# Altium schematic sheet 同向10倍放大.SchDoc
size A4
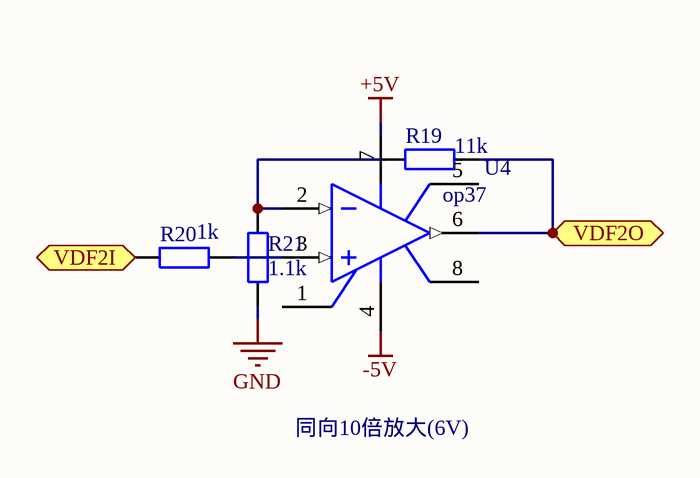
[diagram p0: 同向10倍放大.SchDoc]

## Parts
R19  value 11k  [AXIAL-0.4]  (hidden comment: Res2)
R20  value 1k  [AXIAL-0.4]  (hidden comment: Res2)
R21  value 1.1k  [AXIAL-0.4]  (hidden comment: Res2)
U4  op37  [N-8_A]

## Ports
VDF2I (in), VDF2O (out)

## Nets
+5V: U4.7(V+)
-5V: U4.4(V-)
GND: R21.1
VDF2I: R20.1 ; port VDF2I
VDF2O: R19.2 U4.6(OUT) ; port VDF2O
NetR19_1: R19.1 R21.2 U4.2(IN-)
NetR20_2: R20.2 U4.3(IN+)

Not connected (* = marked no-connect by the designer): U4 1(NULL1) 5(NC) 8(NULL2)

## Notes on the sheet
- 同向10倍放大(6V)
- 标题
- 日期
- 红外数字模拟接收一体机
- 2015 5 29
- 作者
- 模电组
- 单位
- 电子技术协会

## Library data of the parts
R19-R21 = Res2: Resistor; Published: 8-Jun-2000; LatestRevisionDate: 17-Jul-2002; LatestRevisionNote: Re-released for DXP Platform.; PackageReference: AXIAL-0.4; Publisher: Altium Limited
U4 = ADOP07CN: Ultra-Low Offset Voltage Operational Amplifier; Note: Pin 5 is not connected.; Published: 8-Jun-2000; LatestRevisionDate: 04-Mar-2005; LatestRevisionNote: Stylized 3D Model Added.; DatasheetVersion: 1992; PackageReference: N-8_A; Publisher: Altium Limited; PackageDescription: DIP; 8 Leads; Row Spacing 7.62 mm; Pitch 2.54 mm; Code_JEDEC: MO-001-AN; ComponentLink1Description: Manufacturer Link; ComponentLink1URL: http://www.analog.com/